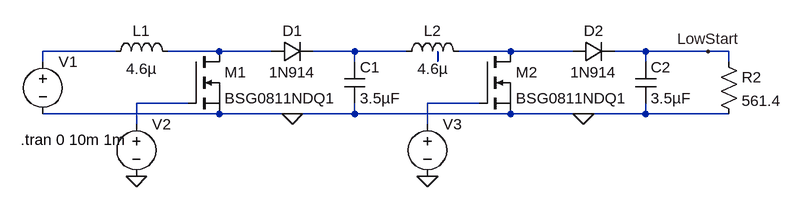
[diagram p0: schematic Double Stage Boost.asc]
Double Stage Boost.asc, the LTspice schematic file:
Version 4
SHEET 1 1172 680
WIRE 144 128 32 128
WIRE 304 128 224 128
WIRE 384 128 304 128
WIRE 512 128 448 128
WIRE 592 128 512 128
WIRE 752 128 672 128
WIRE 848 128 752 128
WIRE 960 128 912 128
WIRE 1056 128 960 128
WIRE 1088 128 1056 128
WIRE 32 144 32 128
WIRE 512 144 512 128
WIRE 640 144 640 128
WIRE 960 144 960 128
WIRE 1088 144 1088 128
WIRE 256 208 176 208
WIRE 704 208 624 208
WIRE 304 224 32 224
WIRE 416 224 304 224
WIRE 512 224 512 208
WIRE 512 224 416 224
WIRE 752 224 512 224
WIRE 864 224 752 224
WIRE 960 224 960 208
WIRE 960 224 864 224
WIRE 1088 224 960 224
WIRE 176 240 176 208
WIRE 624 240 624 208
FLAG 416 224 0
FLAG 176 320 0
FLAG 864 224 0
FLAG 624 320 0
FLAG 1056 128 LowStart
SYMBOL ind 128 144 R270
WINDOW 0 32 56 VTop 2
WINDOW 3 5 56 VBottom 2
SYMATTR InstName L1
SYMATTR Value 4.6µ
SYMATTR SpiceLine Rser=.05
SYMBOL cap 496 144 R0
SYMATTR InstName C1
SYMATTR Value 3.5µF
SYMATTR SpiceLine Rser=0.01
SYMBOL voltage 32 128 R0
WINDOW 3 24 96 Invisible 2
WINDOW 123 0 0 Left 2
WINDOW 39 0 0 Left 2
SYMATTR InstName V1
SYMATTR Value 10
SYMBOL nmos 256 128 R0
SYMATTR InstName M1
SYMATTR Value BSG0811NDQ1
SYMBOL voltage 176 224 R0
WINDOW 3 24 96 Invisible 2
WINDOW 123 0 0 Left 2
WINDOW 39 0 0 Left 2
SYMATTR InstName V2
SYMATTR Value PULSE(0 20 0 1p 1p 7u 10u)
SYMBOL ind 576 144 R270
WINDOW 0 32 56 VTop 2
WINDOW 3 5 56 VBottom 2
SYMATTR InstName L2
SYMATTR Value 4.6µ
SYMATTR SpiceLine Rser=.05
SYMBOL cap 944 144 R0
SYMATTR InstName C2
SYMATTR Value 3.5µF
SYMATTR SpiceLine Rser=0.01
SYMBOL res 1072 128 R0
SYMATTR InstName R2
SYMATTR Value 561.4
SYMBOL nmos 704 128 R0
SYMATTR InstName M2
SYMATTR Value BSG0811NDQ1
SYMBOL diode 848 144 R270
WINDOW 0 32 32 VTop 2
WINDOW 3 0 32 VBottom 2
SYMATTR InstName D2
SYMATTR Value 1N914
SYMBOL voltage 624 224 R0
WINDOW 3 24 96 Invisible 2
WINDOW 123 0 0 Left 2
WINDOW 39 0 0 Left 2
SYMATTR InstName V3
SYMATTR Value PULSE(0 20 7u 1p 1p 3u 10u)
SYMBOL diode 384 144 R270
WINDOW 0 32 32 VTop 2
WINDOW 3 0 32 VBottom 2
SYMATTR InstName D1
SYMATTR Value 1N914
TEXT -2 264 Left 2 !.tran 0 10m 1m

The netlist it stands for:
* Double Stage Boost.asc
L1 N001 N002 4.6µ Rser=.05
C1 N003 0 3.5µF Rser=0.01
V1 N001 0 10
M1 N002 N006 0 0 BSG0811NDQ1
V2 N006 0 PULSE(0 20 0 1p 1p 7u 10u)
L2 N003 N004 4.6µ Rser=.05
C2 LowStart 0 3.5µF Rser=0.01
R2 LowStart 0 561.4
M2 N004 N007 0 0 BSG0811NDQ1
D2 N004 LowStart 1N914
V3 N007 0 PULSE(0 20 7u 1p 1p 3u 10u)
D1 N002 N003 1N914
.model D D
.lib standard.dio
.model NMOS NMOS
.model PMOS PMOS
.lib standard.mos
.tran 0 10m 1m
.backanno
.end